# Altium schematic sheet Footswitches.SchDoc
size A3; SheetNumber: 12; SheetTotal: 13
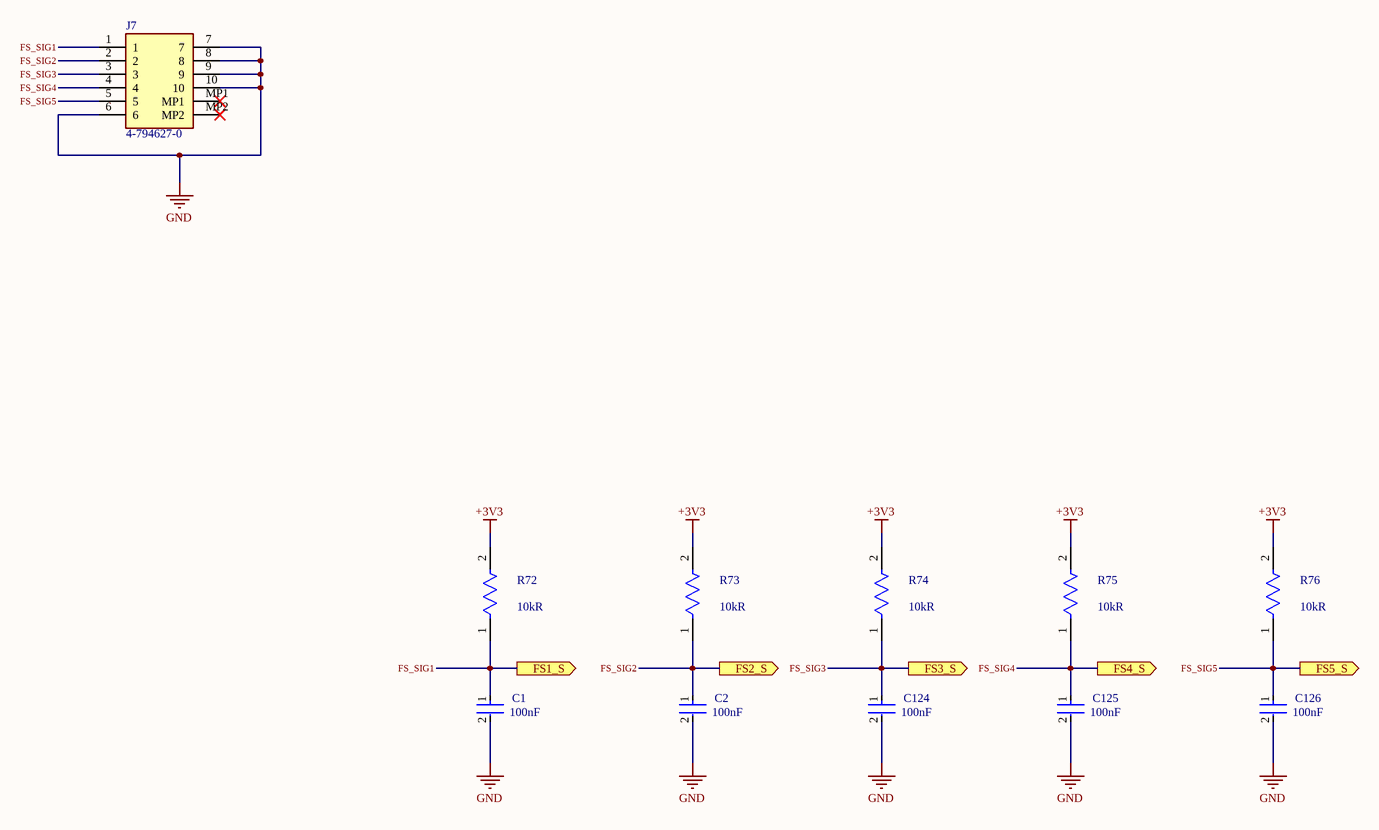
[diagram p0: Footswitches.SchDoc]

## Parts
C1  Capacitance: 100nF  [FP-GCM155-0_05-IPC_A]  (hidden comment: GCM155R71H104ME02J)
C2  Capacitance: 100nF  [FP-GCM155-0_05-IPC_A]  (hidden comment: GCM155R71H104ME02J)
C124  Capacitance: 100nF  [FP-GCM155-0_05-IPC_A]  (hidden comment: GCM155R71H104ME02J)
C125  Capacitance: 100nF  [FP-GCM155-0_05-IPC_A]  (hidden comment: GCM155R71H104ME02J)
C126  Capacitance: 100nF  [FP-GCM155-0_05-IPC_A]  (hidden comment: GCM155R71H104ME02J)
J7  4-794627-0  [47946270]
R72  Resistance: 10kR  [FP-RC0402-0_4-IPC_A]  (hidden comment: RC0402FR-1310KL)
R73  Resistance: 10kR  [FP-RC0402-0_4-IPC_A]  (hidden comment: RC0402FR-1310KL)
R74  Resistance: 10kR  [FP-RC0402-0_4-IPC_A]  (hidden comment: RC0402FR-1310KL)
R75  Resistance: 10kR  [FP-RC0402-0_4-IPC_A]  (hidden comment: RC0402FR-1310KL)
R76  Resistance: 10kR  [FP-RC0402-0_4-IPC_A]  (hidden comment: RC0402FR-1310KL)

## Ports
FS1_S (out, see high_level[3B], MCU_Connections[7C]), FS2_S (out, see high_level[3B], MCU_Connections[7C]), FS3_S (out, see high_level[3B], MCU_Connections[7C]), FS4_S (out, see high_level[3B], MCU_Connections[7C]), FS5_S (out, see high_level[3B], MCU_Connections[7C])

## Nets
+3V3: R72.2 R73.2 R74.2 R75.2 R76.2
GND: C1.2 C2.2 C124.2 C125.2 C126.2 J7.6 J7.7 J7.8 J7.9 J7.10
FS_SIG1: C1.1 J7.1 R72.1 ; port FS1_S
FS_SIG2: C2.1 J7.2 R73.1 ; port FS2_S
FS_SIG3: C124.1 J7.3 R74.1 ; port FS3_S
FS_SIG4: C125.1 J7.4 R75.1 ; port FS4_S
FS_SIG5: C126.1 J7.5 R76.1 ; port FS5_S

Not connected (* = marked no-connect by the designer): J7 MP1* MP2*

## Library data of the parts
C1 C2 C124-C126 = CMP-06035-028957-1: Ceramic Capacitor for Automotive 100nF ±20% 50VDC X7R 0402 Paper T/R
J7 = 4-794627-0: Connector; Manufacturer_Name: TE Connectivity; Datasheet Link: https://www.te.com/commerce/DocumentDelivery/DDEController?Action=srchrtrv&DocNm=micro-mate-n-lok-connector-qrg&DocType=Data%20Sheet&DocLang=English&PartCntxt=4-794627-0&DocFormat=pdf; Height: 8.67mm; Manufacturer_Part_Number: 4-794627-0; Mouser Part Number: 571-4-794627-0; Mouser Price/Stock: https://www.mouser.co.uk/ProductDetail/TE-Connectivity-AMP/4-794627-0?qs=%252BzEhGsOvNvVYq3FriCmQcA%3D%3D; Arrow Part Number: 4-794627-0; Arrow Price/Stock: https://www.arrow.com/en/products/4-794627-0/te-connectivity
R72-R76 = CMP-2002-07854-2: RESISTOR 0402 10K 1%; Power Rating: 62.5mW; Voltage Rating (DC): 50V; Temperature Coefficient: 100ppm/°C; REACH SVHC: No SVHC; Case/Package: 0402; Termination: SMD/SMT; Max Operating Temperature: 155°C; Contact Plating: Tin; Resistance Tolerance: 1%; Radiation Hardening: No; Voltage Rating: 50V; Lead Free: Lead Free; Length: 1mm; Depth: 0.5mm; Number of Pins: 2; RoHS Compliant: Yes; Case Code (Imperial): 0402; Case Code (Metric): 1005; Min Operating Temperature: -55°C; Packaging: Tape and Reel; Technology: THICK FILM; Series: RC; Number of Terminations: 2; Resistor Type: Thick Film; Tolerance: 1%; Working Voltage: 50V; Military Standard: Not; Construction: Rectangular